# EAGLE design LeftHandPath (EAGLE 9.6.2)
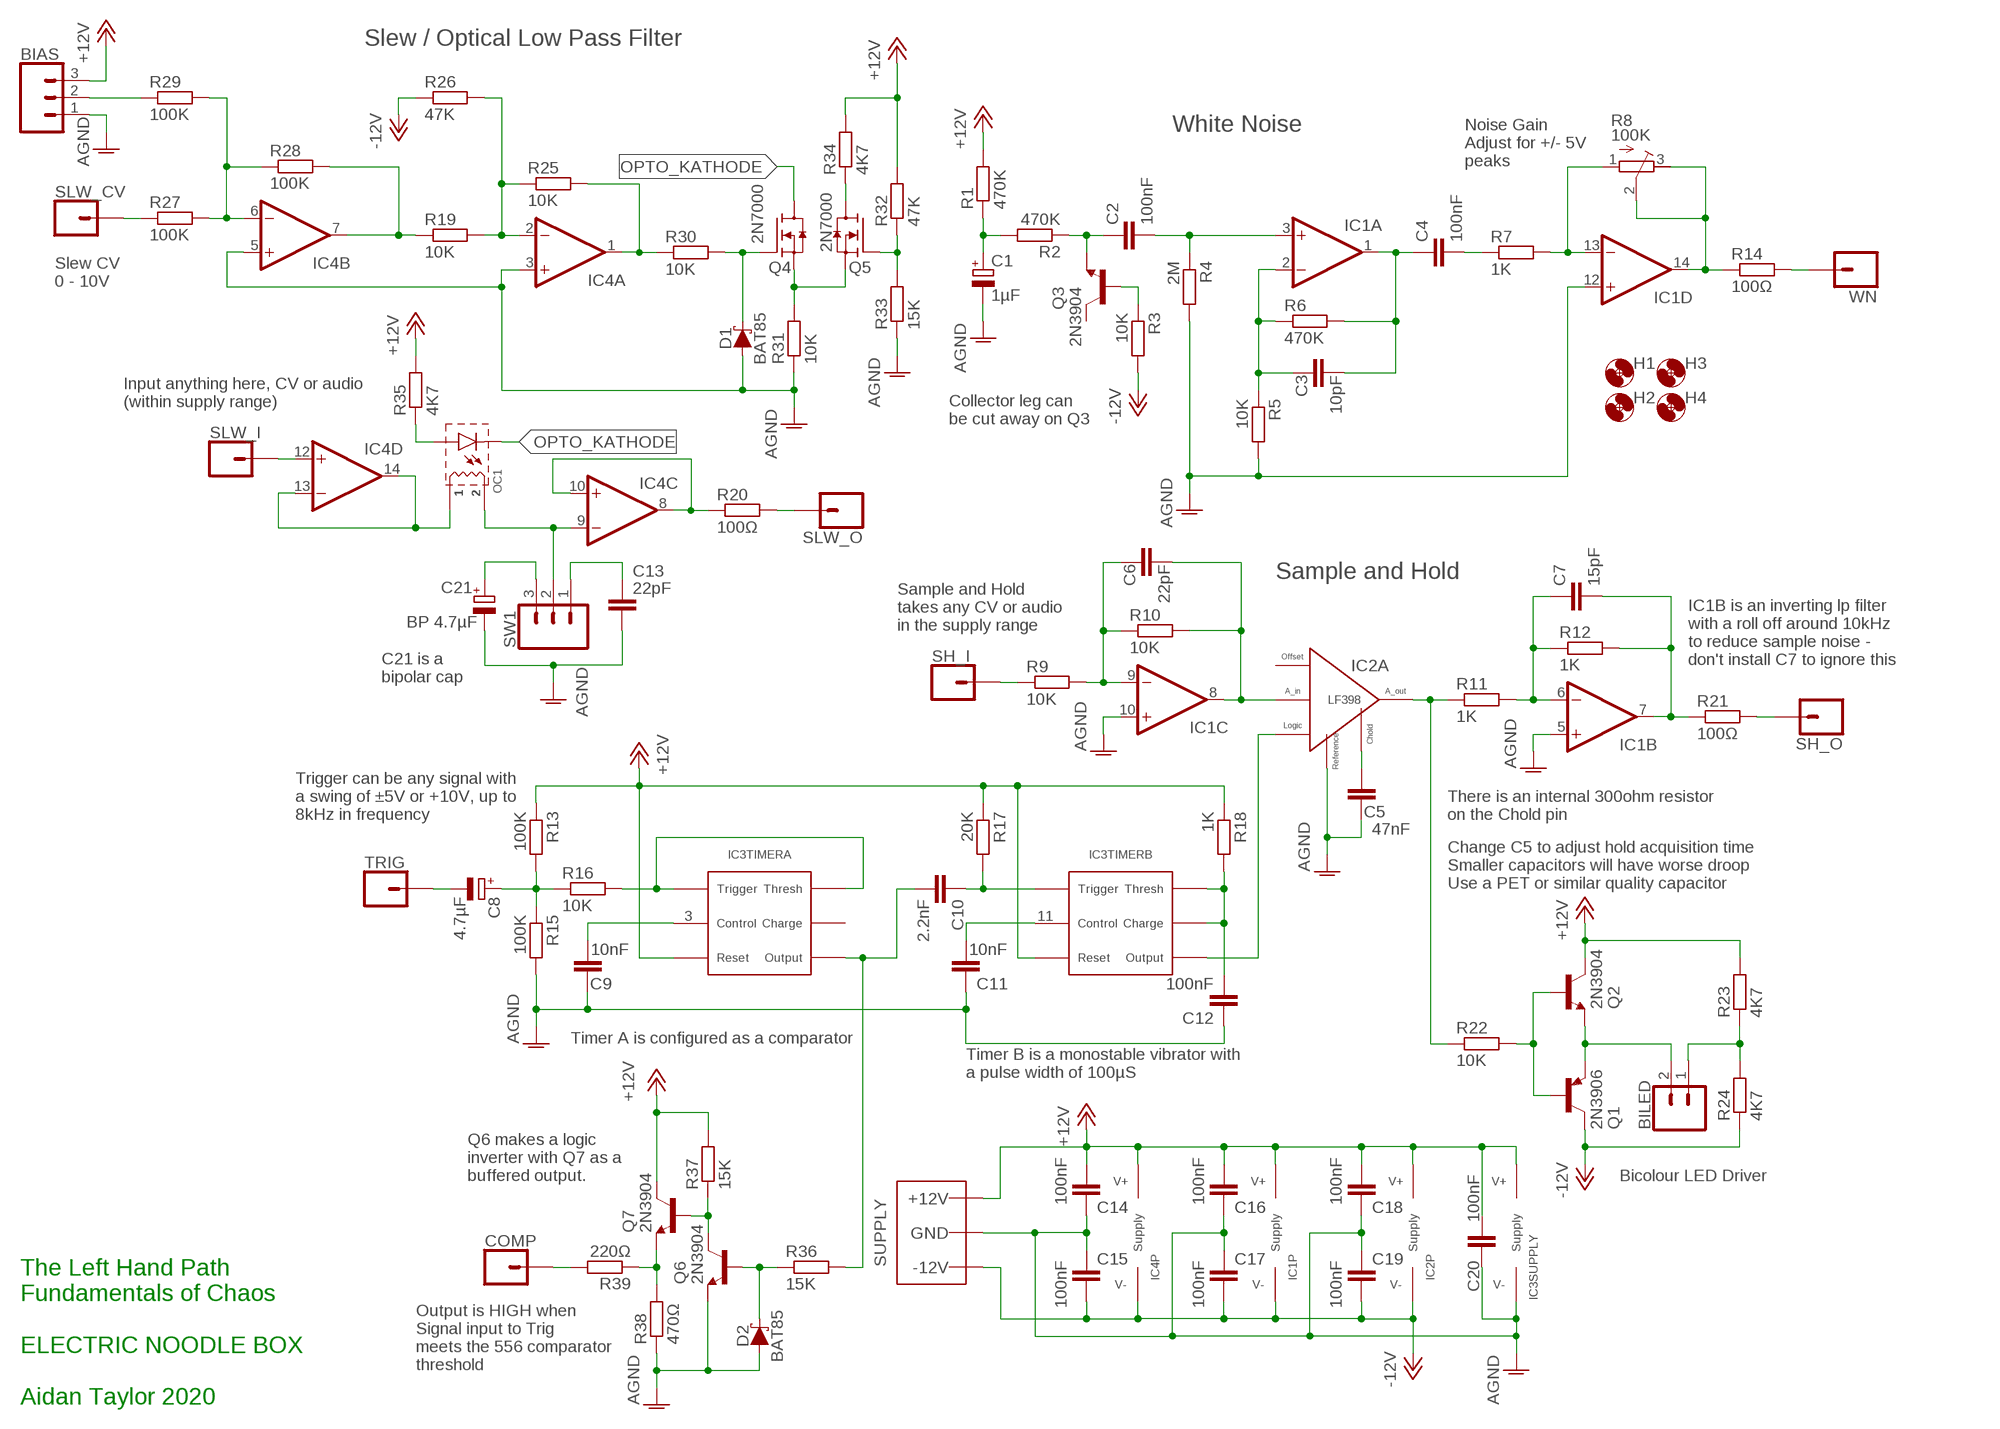
[diagram p0: schematic, sheet 1]

## Parts
BIAS  3XWIREPAD  [1X03]
BILED  2XWIREPAD  [1X02]
C1  1µF  CPOL-EUE2-5  [E2-5]
C2  100nF  C-EU050-025X075  [C050-025X075]
C3  10pF  C-EU050-025X075  [C050-025X075]
C4  100nF  C-EU050-025X075  [C050-025X075]
C5  47nF  C-EU050-025X075  [C050-025X075]
C6  22pF  C-EU050-025X075  [C050-025X075]
C7  15pF  C-EU050-025X075  [C050-025X075]
C8  4.7µF  CPOL-EUE2-5  [E2-5]
C9  10nF  C-EU050-025X075  [C050-025X075]
C10  2.2nF  C-EU050-025X075  [C050-025X075]
C11  10nF  C-EU050-025X075  [C050-025X075]
C12  100nF  C-EU050-025X075  [C050-025X075]
C13  22pF  C-EU050-025X075  [C050-025X075]
C14  100nF  C-EU050-025X075  [C050-025X075]
C15  100nF  C-EU050-025X075  [C050-025X075]
C16  100nF  C-EU050-025X075  [C050-025X075]
C17  100nF  C-EU050-025X075  [C050-025X075]
C18  100nF  C-EU050-025X075  [C050-025X075]
C19  100nF  C-EU050-025X075  [C050-025X075]
C20  100nF  C-EU050-025X075  [C050-025X075]
C21  BP 4.7µF  CPOL-EUE2-5  [E2-5]
COMP  1XWIREPAD  [1X01]
D1  BAT85  SCHOTTKY_DO35  [DO35-7]
D2  BAT85  SCHOTTKY_DO35  [DO35-7]
H1  MOUNT-HOLE3.2  [3,2]
H2  MOUNT-HOLE3.2  [3,2]
H3  MOUNT-HOLE3.2  [3,2]
H4  MOUNT-HOLE3.2  [3,2]
IC1  TL0X4DIL  [DIL14]
IC2  LF398  [DIL08]
IC3  556_DUALTIMERDIL14  [DIL14]
IC4  TL0X4DIL  [DIL14]
OC1  OPTOCOUPLERSILONEX  [SILONEX_OPTOCOUPLER]
Q1  2N3906  [TO92]
Q2  2N3904  [TO92]
Q3  2N3904  [TO92]
Q4  2N7000  [TO92]
Q5  2N7000  [TO92]
Q6  2N3904  [TO92]
Q7  2N3904  [TO92]
R1  470K  R-EU_0207/7  [0207/7]
R2  470K  R-EU_0207/7  [0207/7]
R3  10K  R-EU_0207/7  [0207/7]
R4  2M  R-EU_0207/7  [0207/7]
R5  10K  R-EU_0207/7  [0207/7]
R6  470K  R-EU_0207/7  [0207/7]
R7  1K  R-EU_0207/7  [0207/7]
R8  100K  R-TRIMM3296W  [RTRIM3296W]
R9  10K  R-EU_0207/7  [0207/7]
R10  10K  R-EU_0207/7  [0207/7]
R11  1K  R-EU_0207/7  [0207/7]
R12  1K  R-EU_0207/7  [0207/7]
R13  100K  R-EU_0207/7  [0207/7]
R14  100Ω  R-EU_0207/7  [0207/7]
R15  100K  R-EU_0207/7  [0207/7]
R16  10K  R-EU_0207/7  [0207/7]
R17  20K  R-EU_0207/7  [0207/7]
R18  1K  R-EU_0207/7  [0207/7]
R19  10K  R-EU_0207/7  [0207/7]
R20  100Ω  R-EU_0207/7  [0207/7]
R21  100Ω  R-EU_0207/7  [0207/7]
R22  10K  R-EU_0207/7  [0207/7]
R23  4K7  R-EU_0207/7  [0207/7]
R24  4K7  R-EU_0207/7  [0207/7]
R25  10K  R-EU_0207/7  [0207/7]
R26  47K  R-EU_0207/7  [0207/7]
R27  100K  R-EU_0207/7  [0207/7]
R28  100K  R-EU_0207/7  [0207/7]
R29  100K  R-EU_0207/7  [0207/7]
R30  10K  R-EU_0207/7  [0207/7]
R31  10K  R-EU_0207/7  [0207/7]
R32  47K  R-EU_0207/7  [0207/7]
R33  15K  R-EU_0207/7  [0207/7]
R34  4K7  R-EU_0207/7  [0207/7]
R35  4K7  R-EU_0207/7  [0207/7]
R36  15K  R-EU_0207/7  [0207/7]
R37  15K  R-EU_0207/7  [0207/7]
R38  470Ω  R-EU_0207/7  [0207/7]
R39  220Ω  R-EU_0207/7  [0207/7]
SH_I  1XWIREPAD  [1X01]
SH_O  1XWIREPAD  [1X01]
SLW_CV  1XWIREPAD  [1X01]
SLW_I  1XWIREPAD  [1X01]
SLW_O  1XWIREPAD  [1X01]
SW1  3XWIREPAD  [1X03]
TRIG  1XWIREPAD  [1X01]
WN  1XWIREPAD  [1X01]
WP1  COMBO_SUPPLY_HEADER  [COMBINED_POWER]

## Nets
+12V: BIAS.3 C14.2 C16.2 C18.2 C20.2 IC1.4(P:V+) IC2.1(P:V+) IC3.4(TIMERA:RESET) IC3.10(TIMERB:RESET) IC3.14(SUPPLY:V+) IC4.4(P:V+) Q2.1(C) Q7.1(C) R1.2 R13.1 R17.1 R18.1 R23.2 R32.2 R34.2 R35.2 R37.2 WP1.V+1(V++) WP1.V+2(V++) WP1.V+3(V++)
-12V: C15.1 C17.1 C19.1 IC1.11(P:V-) IC2.4(P:V-) IC4.11(P:V-) Q1.1(C) R3.2 R24.1 R26.1 WP1.V-1(V--) WP1.V-2(V--) WP1.V-3(V--)
AGND: BIAS.1 C1.- C5.1 C9.1 C11.1 C12.1 C13.1 C14.1 C15.2 C16.1 C17.2 C18.1 C19.2 C20.1 C21.- D1.A D2.A IC1.5(B:+IN) IC1.10(C:+IN) IC1.12(D:+IN) IC2.7(A:REFERENCE) IC3.7(SUPPLY:V-) IC4.3(A:+IN) IC4.5(B:+IN) Q6.3(E) R4.2 R5.2 R15.2 R31.1 R33.1 R38.1 WP1.GND1(AGND) WP1.GND2(AGND) WP1.GND3(AGND) WP1.GND4(AGND) WP1.GND5(AGND) WP1.GND6(AGND) WP1.GND7(AGND) WP1.GND8(AGND)
N$1: C1.+ R1.1 R2.2
N$2: C2.1 Q3.3(E) R2.1
N$3: Q3.2(B) R3.1
N$4: C2.2 IC1.3(A:+IN) R4.1
N$5: C3.1 IC1.2(A:-IN) R5.1 R6.1
N$6: C3.2 C4.1 IC1.1(A:OUT) R6.2
N$7: C4.2 R7.1
N$8: IC1.13(D:-IN) R7.2 R8.1(A)
N$9: IC1.14(D:OUT) R8.2(S) R8.3(E) R14.1
N$10: C6.1 IC1.9(C:-IN) R9.2 R10.1
N$11: C6.2 IC1.8(C:OUT) IC2.3(A:ANALOG_IN) R10.2
N$12: C5.2 IC2.6(A:CH)
N$13: IC2.5(A:ANALOG_OUT) R11.1 R22.1
N$14: C7.1 IC1.6(B:-IN) R11.2 R12.1
N$15: C7.2 IC1.7(B:OUT) R12.2 R21.1
N$16: R9.1 SH_I.1
N$17: C10.2 IC3.5(TIMERA:OUTPUT) R36.2
N$18: C8.+ R13.2 R15.1 R16.1
N$19: IC3.2(TIMERA:THRESHOLD) IC3.6(TIMERA:TRIGGER) R16.2
N$20: R14.2 WN.1
N$21: C9.2 IC3.3(TIMERA:CONT)
N$22: C10.1 IC3.8(TIMERB:TRIGGER) R17.2
N$23: C11.2 IC3.11(TIMERB:CONT)
N$24: C12.2 IC3.12(TIMERB:THRESHOLD) IC3.13(TIMERB:DISCHARGE) R18.2
N$25: IC2.8(A:LOGIC) IC3.9(TIMERB:OUTPUT)
N$26: C8.- TRIG.1
N$27: IC4.12(D:+IN) SLW_I.1
N$28: IC4.13(D:-IN) IC4.14(D:OUT) OC1.1(R1)
N$29: IC4.7(B:OUT) R19.1 R28.2
N$30: IC4.9(C:-IN) OC1.2(R2) SW1.2
N$31: IC4.8(C:OUT) IC4.10(C:+IN) R20.1
N$32: R20.2 SLW_O.1
N$33: R21.2 SH_O.1
N$34: Q1.2(B) Q2.2(B) R22.2
N$35: BILED.2 Q1.3(E) Q2.3(E)
N$36: BILED.1 R23.1 R24.2
N$37: IC4.2(A:-IN) R19.2 R25.1 R26.2
N$38: IC4.6(B:-IN) R27.2 R28.1 R29.2
N$39: IC4.1(A:OUT) R25.2 R30.1
N$40: D1.C Q4.2(G) R30.2
N$41: Q4.1(S) Q5.1(S) R31.2
N$42: C21.+ SW1.3
N$43: Q5.2(G) R32.1 R33.2
N$44: Q5.3(D) R34.1
N$45: OC1.A R35.1
N$46: C13.2 SW1.1
N$47: R27.1 SLW_CV.1
N$48: BIAS.2 R29.1
N$49: Q6.1(C) Q7.2(B) R37.1
N$50: Q7.3(E) R38.2 R39.1
N$51: COMP.1 R39.2
N$52: D2.C Q6.2(B) R36.1
OPTO_KATHODE: OC1.K Q4.3(D)
Unconnected: IC2.2(A:OFFSET) IC3.1(TIMERA:DISCHARGE) Q3.1(C)

## Notes on the sheet
- Slew / Optical Low Pass Filter
- White Noise
- Noise Gain
  Adjust for +/- 5V
  peaks
- Slew CV
  0 - 10V
- Input anything here, CV or audio
  (within supply range)
- Collector leg can 
  be cut away on Q3
- Sample and Hold
- Sample and Hold
  takes any CV or audio
  in the supply range
- IC1B is an inverting lp filter
  with a roll off around 10kHz
  to reduce sample noise - 
  don't install C7 to ignore this
- C21 is a 
  bipolar cap
- Trigger can be any signal with 
  a swing of ±5V or +10V, up to 
  8kHz in frequency
- There is an internal 300ohm resistor
  on the Chold pin
- Change C5 to adjust hold acquisition time
  Smaller capacitors will have worse droop
  Use a PET or similar quality capacitor
- Timer A is configured as a comparator
- Timer B is a monostable vibrator with 
  a pulse width of 100µS
- Q6 makes a logic
  inverter with Q7 as a 
  buffered output.
- Bicolour LED Driver
- Output is HIGH when
  Signal input to Trig
  meets the 556 comparator
  threshold
- The Left Hand Path
  Fundamentals of Chaos
  
  ELECTRIC NOODLE BOX
  
  Aidan Taylor 2020

## Library data of the parts
BIAS SW1 = ElectricNoodleBox:3XWIREPAD
BILED = ElectricNoodleBox:2XWIREPAD
C1 C8 C21 = rcl:CPOL-EU: POLARIZED CAPACITOR, European symbol; SPICEPREFIX: C
C2-C7 C9-C20 = rcl:C-EU: CAPACITOR, European symbol; SPICEPREFIX: C
COMP SH_I SH_O SLW_CV SLW_I SLW_O TRIG WN = ElectricNoodleBox:1XWIREPAD
D1 D2 = ElectricNoodleBox:SCHOTTKY_DO35
H1-H4 = holes:MOUNT-HOLE: MOUNTING HOLE with drill center marker
IC1 IC4 = ElectricNoodleBox:TL0X4
IC2 = ElectricNoodleBox:LF398
IC3 = ElectricNoodleBox:556_DUALTIMER
OC1 = ElectricNoodleBox:OPTOCOUPLER
Q1 = transistor-pnp:2N3906: PNP Transistor
Q2 Q3 Q6 Q7 = transistor:2N3904: NPN TRANSISTOR
Q4 Q5 = ElectricNoodleBox:2N7000
R1-R7 R9-R39 = rcl:R-EU_: RESISTOR, European symbol; SPICEPREFIX: R
R8 = rcl:R-TRIMM: Trimm resistor; SPICEMODEL: X; SPICEPREFIXL: POT
WP1 = ElectricNoodleBox:COMBO_SUPPLY_HEADER

## Board
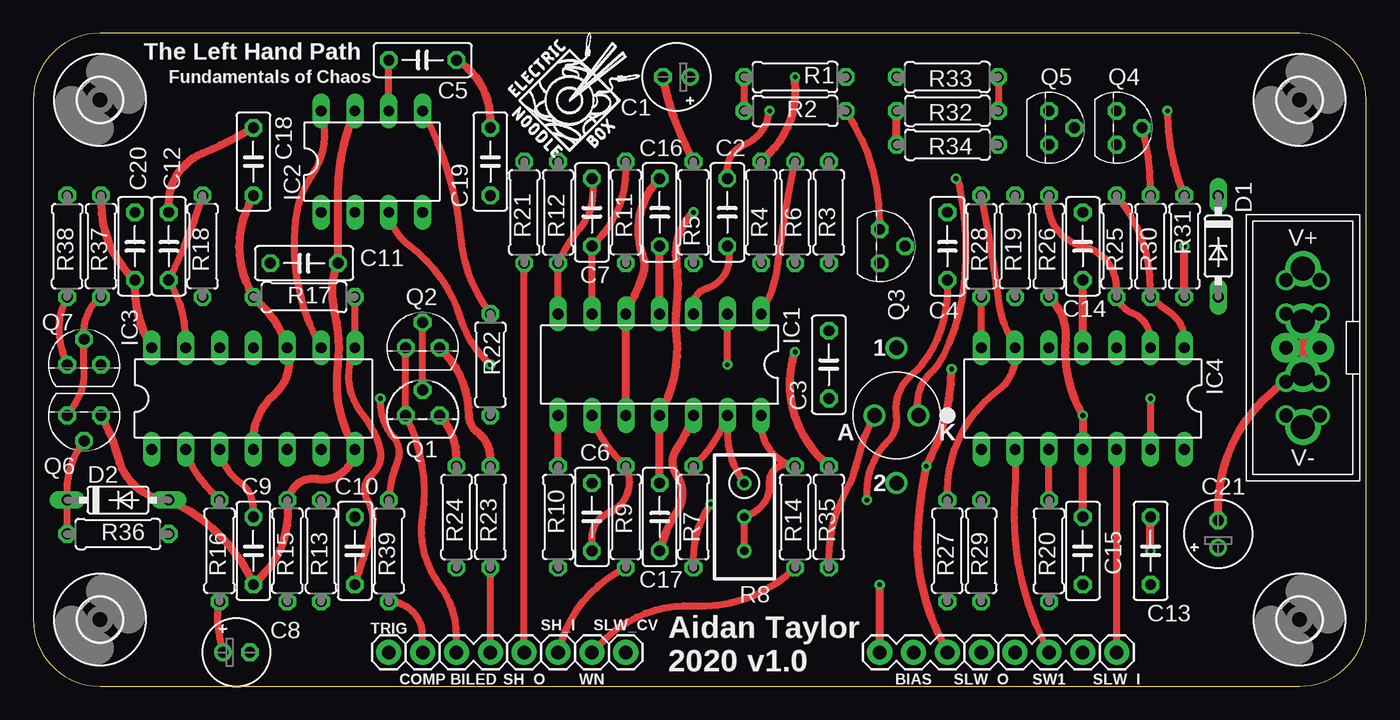
[diagram p1: board, top side]
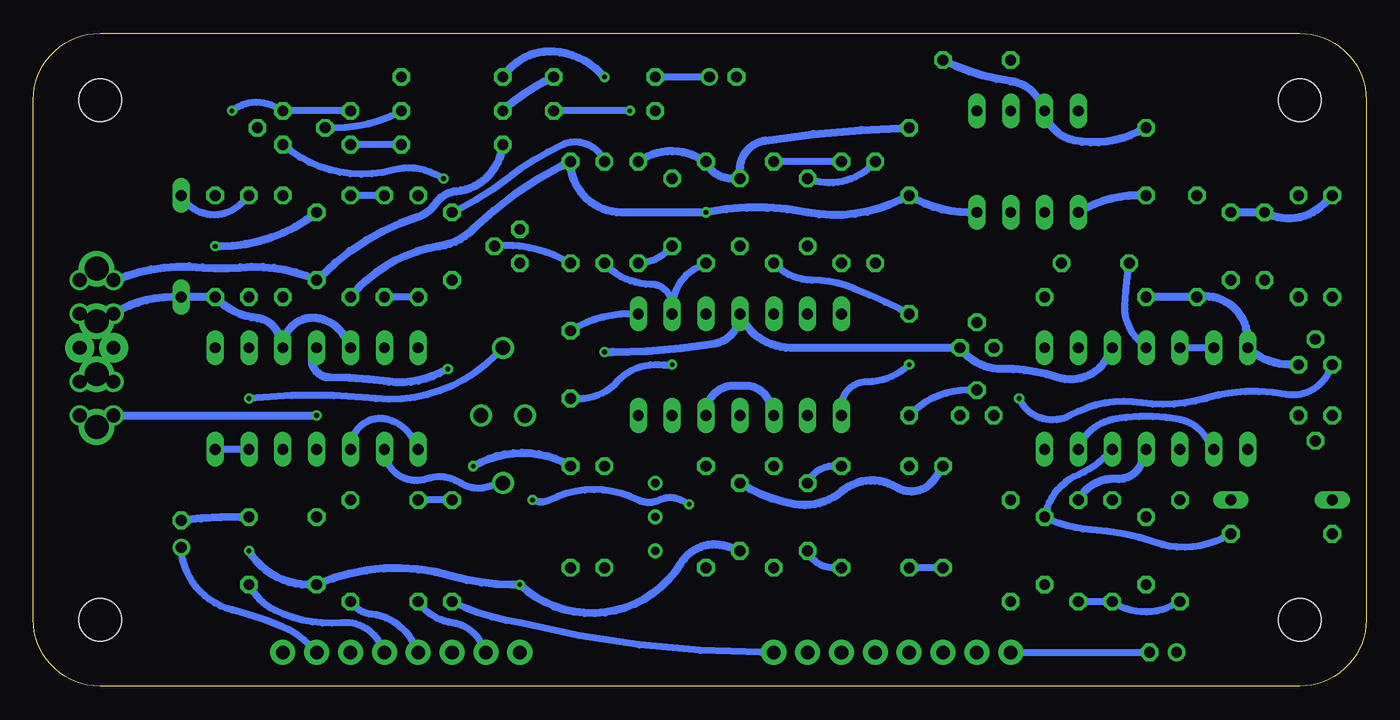
[diagram p2: board, bottom side, seen from below]

Size 100 x 49 mm. Coordinates in mm from the lower left corner, seen from the top.
Outline: 5,0 95,0 arc90 100,5 100,44 arc90 95,49 5,49 arc90 0,44 0,5 arc90 5,0
Copper layers (1*16): Top 0.035mm / dielectric 1.5mm / Bottom 0.035mm
Design rules "default": minimum track width 6mil, minimum drill 0.35mm, track to track 6mil, track to pad 6mil, pad to pad 6mil, via to via 6mil, smd to smd 6mil, copper to edge 40mil, drill to drill 6mil, minimum pad ring 10mil, minimum via ring 8mil, stop-mask expansion 4mil, vias tented up to drill 0mil, thermal gap 10mil

### Footprints (pad centres in the part's own frame; a part is rotated, then mirrored left to right if it is on the bottom)
1X03 = drill 1.016 pad 1.88: 1 0,0; 2 2.54,0; 3 5.08,0
1X02 = drill 1.016 pad 1.88: 1 0,0; 2 2.54,0
E2-5 = drill 0.813 pad 1.27: + -1.016,0 | drill 0.813 pad 1.27 octagon: - 1.016,0
C050-025X075 = drill 0.813 octagon: 1 -2.54,0; 2 2.54,0
1X01 = drill 1.016 pad 1.88: 1 0,0
DO35-7 = drill 0.813 long: A 3.81,0; C -3.81,0
3,2 = hole 3.2: 0,0
DIL14 = drill 0.813 long: 1 -7.62,-3.81; 2 -5.08,-3.81; 3 -2.54,-3.81; 4 0,-3.81; 5 2.54,-3.81; 6 5.08,-3.81; 7 7.62,-3.81; 8 7.62,3.81; 9 5.08,3.81; 10 2.54,3.81; 11 0,3.81; 12 -2.54,3.81; 13 -5.08,3.81; 14 -7.62,3.81
DIL08 = drill 0.813 long: 1 -3.81,-3.81; 2 -1.27,-3.81; 3 1.27,-3.81; 4 3.81,-3.81; 5 3.81,3.81; 6 1.27,3.81; 7 -1.27,3.81; 8 -3.81,3.81
SILONEX_OPTOCOUPLER = drill 1.1: 1 0,5.08; 2 0,-5.08; A -1.65,0; K 1.65,0
TO92 = drill 0.813 octagon: 1 1.27,0; 2 0,1.905; 3 -1.27,0
TO92' = drill 0.813 octagon: 1 -1.27,0; 2 0,1.905; 3 1.27,0
0207/7 = drill 0.813 octagon: 1 -3.81,0; 2 3.81,0
RTRIM3296W = drill 0.61: 1 0,-2.54; 2 0,0; 3 0,2.54
COMBINED_POWER = drill 1.78: GND1 -1.98,0; GND2 1.98,0; V+1 -5.94,0; V-1 5.94,0 | drill 1.016: GND3 -2.54,1.27; GND5 2.54,1.27; GND6 -2.54,-1.27; GND8 2.54,-1.27; V+2 -5.08,1.27; V+3 -5.08,-1.27; V-2 5.08,1.27; V-3 5.08,-1.27 | drill 1.016 pad 2.184: GND4 0,1.27; GND7 0,-1.27

### Placement (x,y rotation side)
BIAS  63.5,2.54 0 top
BILED  34.29,2.54 180 top
C1  48.26,45.72 180 top
C2  52.07,35.56 270 top
C3  59.69,24.13 90 top
C4  68.58,33.02 270 top
C5  29.21,46.99 180 top
C6  41.91,12.7 90 top
C7  41.91,35.56 90 top
C8  15.24,2.54 0 top
C9  16.51,10.16 90 top
C10  24.13,10.16 90 top
C11  20.32,31.75 180 top
C12  10.16,33.02 270 top
C13  83.82,10.16 270 top
C14  78.74,33.02 270 top
C15  78.74,10.16 270 top
C16  46.99,35.56 270 top
C17  46.99,12.7 270 top
C18  16.51,39.37 270 top
C19  34.29,39.37 90 top
C20  7.62,33.02 270 top
C21  88.9,11.43 90 top
COMP  29.21,2.54 270 top
D1  88.9,33.02 270 top
D2  6.35,13.97 0 top
H1  5,5 0 top
H2  5,44 0 top
H3  95,44 0 top
H4  95,5 0 top
IC1  46.99,24.13 180 top
IC2  25.4,39.37 0 top
IC3  16.51,21.59 0 top
IC4  78.74,21.59 180 top
OC1  64.77,20.32 0 top
Q1  29.21,20.32 0 top
Q2  29.21,25.4 0 top
Q3  63.5,33.02 270 top
Q4  2N7000  [TO92']  81.28,41.91 270 top
Q5  2N7000  [TO92']  76.2,41.91 270 top
Q6  3.81,20.32 180 top
Q7  3.81,24.13 0 top
R1  57.15,45.72 0 top
R2  57.15,43.18 180 top
R3  59.69,35.56 90 top
R4  54.61,35.56 90 top
R5  49.53,35.56 90 top
R6  57.15,35.56 90 top
R7  49.53,12.7 90 top
R8  53.34,12.7 180 top
R9  44.45,12.7 90 top
R10  39.37,12.7 90 top
R11  44.45,35.56 90 top
R12  39.37,35.56 270 top
R13  21.59,10.16 270 top
R14  57.15,12.7 270 top
R15  19.05,10.16 90 top
R16  13.97,10.16 90 top
R17  20.32,29.21 0 top
R18  12.7,33.02 90 top
R19  73.66,33.02 90 top
R20  76.2,10.16 270 top
R21  36.83,35.56 270 top
R22  34.29,24.13 270 top
R23  34.29,12.7 90 top
R24  31.75,12.7 270 top
R25  81.28,33.02 90 top
R26  76.2,33.02 90 top
R27  68.58,10.16 90 top
R28  71.12,33.02 270 top
R29  71.12,10.16 90 top
R30  83.82,33.02 90 top
R31  86.36,33.02 90 top
R32  68.58,43.18 180 top
R33  68.58,45.72 0 top
R34  68.58,40.64 180 top
R35  59.69,12.7 90 top
R36  6.35,11.43 0 top
R37  5.08,33.02 90 top
R38  2.54,33.02 270 top
R39  26.67,10.16 270 top
SH_I  39.37,2.54 270 top
SH_O  36.83,2.54 270 top
SLW_CV  44.45,2.54 270 top
SLW_I  81.28,2.54 90 top
SLW_O  71.12,2.54 90 top
SW1  73.66,2.54 0 top
TRIG  26.67,2.54 90 top
U$1  [LOGO10X10]  35.56,39.37 0 top
WN  41.91,2.54 90 top
WP1  95.25,25.4 270 top

### Tracks (layer width: path | path; a pad name or v marks a point on that pad's centre or on a via)
+12V  (via drill 0.35)
  Top 0.61: BIAS.3 68.26,3.17 arc-10 66.99,6.35 arc-20 66.36,11.43 arc-9 v66.99,16.51 67.31,17.14 arc26 v68.9,23.81 | IC4.4 C14.2 | IC3.4 16.51,18.41 arc-49 18.1,21.91 arc67 IC3.10 arc28 17.14,28.57 R17.1 arc-58 16.19,36.2 C18.2 | R23.2 34.29,17.14 arc53 33.34,19.05 arc-53 32.7,20.32 arc47 Q2.1 | R35.2 59.05,17.14 arc-63 v57.15,25.08 | R34.2 R32.2 | IC1.4 C16.2 | IC3.14 arc-32 7.62,29.84 C20.2 arc-48 5.08,36.2 R37.2 | WP1.V+3 WP1.V+1 WP1.V+2
  Bottom 0.61: v66.99,16.51 66.45,16.78 arc58 R35.2 | v68.9,23.81 69.53,23.5 arc34 73.34,22.86 arc-7 77.79,23.18 arc133 IC4.4 | Q7.1 5.71,24.13 arc44 IC3.14 8.89,26.04 arc-100 R18.1 R17.1 | IC3.4 16.83,16.83 arc76 18.73,15.56 arc-66 R13.1 | v57.15,25.08 56.52,25.08 arc-10 48.9,25.72 arc-80 IC1.4 arc-67 43.18,25.4 Q2.1 arc-55 27.3,23.81 arc19 23.18,23.18 arc-82 19.37,24.77 IC3.10 | WP1.V+3 93.03,30.8 arc24 87.31,31.43 arc-12 84.45,31.43 arc30 C14.2 78.42,30.8 arc27 71.12,35.24 arc-38 69.85,36.2 arc50 68.26,37.15 arc-78 R34.2 | R1.2 61.59,45.4 arc-17 R32.2 | C18.2 17.14,36.83 arc-32 IC2.1
-12V  (via drill 0.35)
  Top 0.61: C15.1 IC4.11 v78.74,20.32 78.42,20.95 arc-23 77.47,24.45 arc-8 77.47,26.04 arc51 R26.1 | R24.1 31.75,17.14 arc44 Q1.1 | C17.1 IC1.11 47.31,20.95 arc33 48.26,26.35 arc-13 48.26,28.26 arc13 48.26,32.07 arc-53 v49.53,35.56 | WP1.V-3 WP1.V-1 WP1.V-2
  Bottom 0.61: WP1.V-3 v78.74,20.32 | R24.1 32.38,15.56 arc88 35.24,14.92 arc-71 39.37,14.61 arc50 42.86,13.65 arc23 C17.1 | R26.1 arc42 69.53,33.02 arc-36 66.99,34.29 arc18 60.33,39.05 R3.2 arc-90 55.88,35.56 v49.53,35.56 arc22 41.91,35.56 arc-38 34.92,36.51 C19.1 arc-32 29.84,35.56 IC2.4
AGND  (via drill 0.35)
  Top 0.61: BIAS.1 63.5,4.76 v63.5,7.62 | v83.82,10.16 C13.1 | C17.2 47.31,11.11 arc-16 48.26,13.02 arc69 48.26,15.88 arc-69 48.26,17.78 arc16 IC1.12 | C21.- 88.9,13.34 arc-56 WP1.GND8 WP1.GND2 | Q6.3 5.4,19.68 arc-12 6.35,17.14 arc71 D2.A 10.79,13.65 arc-40 C9.1 17.14,8.26 arc53 R15.2 19.37,14.61 arc-74 21.27,15.56 arc96 IC3.7 23.81,18.41 arc-34 22.86,24.13 arc15 22.86,26.67 arc4 22.54,28.57 arc-34 C11.1 22.86,36.83 arc-23 IC2.7 | IC1.10 IC1.5 44.77,28.57 arc7 45.72,30.8 arc40 45.72,32.38 arc-65 C16.1 | R31.1 v86.36,33.02 | R5.2 49.21,40.01 arc-15 C1.- | R4.2 55.24,40.01 arc51 57.15,45.4 arc-12 v57.15,45.72 | C19.2 34.29,42.55 arc59 C5.1 | C12.1 10.16,36.2 arc-67 12.7,40.01 arc8 C18.1 | WP1.GND2 WP1.GND5 | WP1.GND2 WP1.GND4 | WP1.GND4 WP1.GND1 | WP1.GND1 WP1.GND7 | WP1.GND7 WP1.GND4 | WP1.GND7 WP1.GND2 | WP1.GND1 WP1.GND2 | WP1.GND1 WP1.GND6 | WP1.GND1 WP1.GND3
  Bottom 0.61: v83.82,10.16 arc-59 79.38,7.62 C15.2 arc40 68.58,8.26 arc-16 64.14,7.62 v63.5,7.62 arc-102 51.44,9.21 arc77 47.94,10.48 C17.2 | C13.1 84.45,12.7 arc-7 C21.- | IC4.5 76.52,26.04 arc-56 78.74,27.62 arc-98 IC4.3 81.6,26.35 arc-66 83.19,27.62 arc42 R31.1 D1.A 89.53,29.21 arc-32 WP1.GND6 | IC1.10 44.77,21.27 arc-76 46.67,22.54 arc8 47.31,22.54 arc-98 IC1.12 | v86.36,33.02 86.04,33.02 arc-38 C14.1 | R4.2 arc61 50.16,39.69 R5.2 arc-67 47.62,38.1 C16.1 46.99,38.73 arc81 45.09,40.96 arc8 C19.2 | v57.15,45.72 57.47,46.04 arc-41 60.96,47.62 arc-61 R33.1 | C5.1 arc-19 26.67,45.4 arc56 24.45,43.81 IC2.7 arc-67 21.91,40.96 arc-38 17.14,41.59 C18.1 | C12.1 C20.1 arc-74 3.17,36.2 R38.1
N$1
  Top 0.508: R2.2 R1.1
  Bottom 0.508: C1.+ R1.1
N$2  (via drill 0.35)
  Top 0.508: Q3.3 63.5,34.92 arc34 R2.1 | C2.1 52.07,38.73 arc-67 53.34,40.64 arc61 v55.24,43.18
  Bottom 0.508: v55.24,43.18 R2.1
N$3
  Bottom 0.508: R3.1 60.33,32.07 arc-20 63.5,33.02 arc-14 Q3.2
N$4
  Top 0.508: IC1.3 49.53,28.57 arc-74 50.48,29.84 arc94 C2.2
  Bottom 0.508: C2.2 52.39,32.7 arc44 R4.1
N$5  (via drill 0.35)
  Top 0.508: v52.07,24.13 IC1.2
  Bottom 0.508: C3.1 59.05,21.59 arc-48 56.2,22.86 arc52 53.02,24.13 arc-9 v52.07,24.13 | 52.07,28.57 arc-90 53.66,30.16 arc49 R6.1 | IC1.2 52.07,28.57 | R5.1 50.16,31.43 arc-59 52.07,28.57
N$6
  Top 0.508: IC1.1 54.93,28.57 arc20 55.88,31.75 arc-5 R6.2
  Bottom 0.508: IC1.1 55.24,27.94 arc-32 C3.2 | C4.1 67.94,35.88 arc-12 64.45,38.1 arc14 60.33,40.64 arc93 R6.2
N$7  (via drill 0.35)
  Top 0.508: R7.1 49.53,9.53 arc-34 v50.8,13.65 | v62.55,13.97 62.55,14.61 arc-45 64.14,18.41 arc54 64.77,20.32 arc-60 66.04,23.5 arc14 66.67,24.13 arc43 C4.2
  Bottom 0.508: v50.8,13.65 51.44,13.97 arc-53 53.02,13.97 arc53 54.61,13.97 arc-53 61.28,13.97 arc53 v62.55,13.97
N$8
  Top 0.508: R7.2 49.85,16.83 arc25 IC1.13 52.07,19.05 arc37 R8.1
N$9
  Top 0.508: R8.3 R8.2 53.98,13.02 arc67 55.24,15.24 arc-121 R14.1 arc-77 54.61,19.68 IC1.14
N$10
  Top 0.508: C6.1 41.91,11.11 arc-67 43.18,13.02 arc95 R9.2 43.81,17.14 arc-28 IC1.9
  Bottom 0.508: R10.1 40.01,8.89 arc67 C6.1
N$11  (via drill 0.35)
  Top 0.508: R10.2 IC1.8 | v34.29,24.13 33.97,24.45 arc-28 32.07,27.62 arc37 28.26,33.02 arc-43 IC2.3
  Bottom 0.508: R10.2 40.01,16.51 arc-67 C6.2 | IC1.8 39.37,20.95 arc90 37.47,22.86 arc-44 v34.29,24.13
N$12
  Top 0.508: IC2.6 C5.2
N$13
  Top 0.508: IC2.5 29.53,42.55 arc-21 32.07,33.66 arc32 R22.1
  Bottom 0.508: R22.1 34.92,28.26 arc-4 38.42,29.84 arc-22 41.59,30.48 arc47 R11.1
N$14
  Top 0.508: IC1.6 C7.1 42.23,33.34 arc50 R11.2
  Bottom 0.508: R12.1 R11.2
N$15
  Top 0.508: IC1.7 R12.2 39.69,32.38 arc-14 40.96,34.29 arc54 C7.2
  Bottom 0.508: R21.1 37.15,39.05 arc42 40.01,37.78 arc25 C7.2
N$16
  Top 0.508: SH_I.1 39.69,3.49 arc-46 R9.1
N$17
  Bottom 0.508: R36.2 10.79,11.11 arc46 15.88,10.79 arc-16 20.64,11.75 arc24 C10.2 arc58 21.59,15.88 arc-23 19.68,17.14 IC3.5
N$18
  Top 0.508: C8.+ 13.97,3.81 arc-23 R16.1
  Bottom 0.508: R16.1 14.61,6.03 arc61 R15.1 R13.2
N$19
  Top 0.508: R16.2 13.34,14.61 arc-28 IC3.2
  Bottom 0.508: IC3.2 12.06,18.73 arc-45 13.97,20 arc-22 19.05,20 arc-60 IC3.6
N$20
  Top 0.508: WN.1 42.86,3.49 arc-48 49.53,6.03 arc48 R14.2
N$21
  Top 0.508: C9.2 16.51,13.34 arc53 15.56,15.24 arc-42 IC3.3
N$22
  Top 0.508: C10.1 24.45,8.57 arc3 25.4,11.75 arc46 25.08,13.97 arc-81 25.4,15.88 arc63 26.04,17.78 arc27 24.77,20.32 arc-65 IC3.8 R17.2
N$23
  Bottom 0.508: IC3.11 17.14,26.04 arc49 18.1,28.57 arc4 C11.2
N$24
  Top 0.508: IC3.13 11.43,26.04 arc32 C12.2 10.48,31.11 arc11 R18.2
  Bottom 0.508: IC3.13 IC3.12
N$25
  Top 0.508: IC3.9 21.27,26.04 arc-33 19.68,34.92 arc-27 20.95,38.42 arc52 IC2.8
N$26
  Bottom 0.508: TRIG.1 C8.-
N$27
  Top 0.508: SLW_I.1 IC4.12
N$28  (via drill 0.35)
  Top 0.508: v83.82,21.59 IC4.13
  Bottom 0.508: IC4.13 IC4.14 | OC1.1 65.41,24.77 arc51 74.3,21.59 arc-11 v83.82,21.59
N$29
  Top 0.508: IC4.7 R28.2
  Bottom 0.508: R28.2 R19.1
N$30
  Top 0.508: SW1.2 75.88,3.17 arc-31 73.66,14.29 arc8 IC4.9
  Bottom 0.508: OC1.2 66.04,14.92 arc47 67.94,15.24 arc-52 70.48,15.56 arc107 IC4.9
N$31
  Top 0.508: R20.1 IC4.10
  Bottom 0.508: IC4.8 71.44,18.41 arc-47 73.34,20 arc-108 IC4.10
N$32
  Bottom 0.508: SLW_O.1 71.44,3.17 arc-57 74.61,5.4 arc49 R20.2
N$33
  Top 0.508: SH_O.1 R21.2
N$34
  Top 0.508: Q1.2 Q2.2
  Bottom 0.508: Q1.2 29.84,22.23 arc-46 R22.2
N$35
  Top 0.508: BILED.2 31.75,3.81 arc37 30.48,7.62 arc-46 29.21,12.7 arc37 Q1.3 Q2.3
N$36
  Top 0.508: BILED.1 R23.1
  Bottom 0.508: R24.2 R23.1
N$37
  Top 0.508: IC4.2 83.82,26.04 arc67 82.55,27.94 arc-45 R25.1 81.28,29.84 arc77 78.74,33.02 arc-87 R26.2
  Bottom 0.508: R19.2 R26.2
N$38
  Top 0.508: R27.2 68.58,14.61 arc-30 69.85,19.37 arc-24 72.39,22.23 arc63 IC4.6 73.34,26.04 arc-20 72.39,29.21 arc5 R28.1
  Bottom 0.508: R27.2 R29.2
N$39
  Top 0.508: IC4.1 86.36,26.04 arc53 85.41,27.94 arc-4 R30.1 83.82,29.84 arc40 R25.2
N$40
  Top 0.508: R30.2 83.82,37.47 arc16 Q4.2
  Bottom 0.508: R30.2 84.45,36.2 arc106 D1.C
N$41  (via drill 0.35)
  Top 0.508: v85.09,43.18 85.09,42.86 arc24 R31.2
  Bottom 0.508: v85.09,43.18 arc65 81.92,43.5 Q4.1 Q5.1
N$42
  Bottom 0.508: SW1.3 79.38,3.17 arc-23 81.28,4.45 arc-8 85.09,5.71 arc73 C21.+
N$43
  Top 0.508: R33.2 R32.1
  Bottom 0.508: Q5.2 77.47,41.91 arc-28 R32.1
N$44
  Bottom 0.508: R34.1 Q5.3
N$45
  Top 0.508: R35.1 59.69,9.53 arc-28 60.96,14.61 arc15 61.91,17.14 arc-16 OC1.A
N$46
  Bottom 0.508: SW1.1 73.98,3.17 arc-69 76.83,4.76 arc32 81.92,5.71 arc37 C13.2
N$47
  Bottom 0.508: R27.1 arc-19 63.5,4.76 arc-14 45.4,2.54 SLW_CV.1
N$48
  Bottom 0.508: BIAS.2 66.36,3.17 arc-56 68.58,4.76 arc49 R29.1
N$49
  Top 0.508: Q6.1 3.17,21.27 arc35 3.81,23.5 arc-4 Q7.2 3.81,26.67 arc-53 R37.1
N$50  (via drill 0.35)
  Top 0.508: Q7.3 2.22,25.08 arc-46 R38.2 | v26.04,21.59 26.04,21.27 arc41 26.99,18.73 arc-63 27.3,16.83 arc19 R39.1
  Bottom 0.508: Q7.3 2.86,23.5 arc74 6.03,21.91 arc-27 12.06,21.59 arc25 16.83,21.27 arc-37 22.23,20.32 arc94 v26.04,21.59
N$51
  Top 0.508: COMP.1 29.21,3.81 arc90 R39.2
N$52
  Top 0.508: R36.1 D2.C 2.54,14.61 arc-37 Q6.2
OPTO_KATHODE  (via drill 0.35)
  Top 0.508: OC1.K 66.36,20.95 arc-52 67.31,23.5 arc20 68.26,24.77 arc21 69.85,30.16 arc17 69.53,37.47 arc32 v69.22,38.1
  Bottom 0.508: v69.22,38.1 69.85,38.42 arc-42 73.03,38.73 arc56 Q4.3

### Text on the board
tPlace: The Left Hand Path | Fundamentals of Chaos | Aidan Taylor / 2020 v1.0